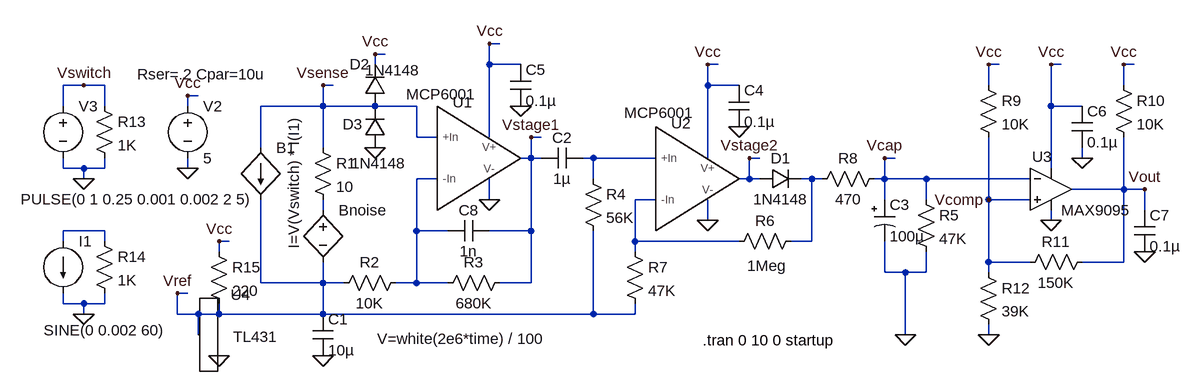
[diagram p0: schematic AutoVac1.asc]
AutoVac1.asc, the LTspice schematic file:
Version 4
SHEET 1 2052 736
WIRE 160 64 144 64
WIRE -16 80 -32 80
WIRE -32 96 -32 80
WIRE 144 96 144 64
WIRE 192 96 144 96
WIRE 496 96 480 96
WIRE 928 96 912 96
WIRE 1024 96 1008 96
WIRE 1136 96 1120 96
WIRE -480 128 -512 128
WIRE -448 128 -480 128
WIRE -96 128 -112 128
WIRE 480 128 480 96
WIRE 528 128 480 128
WIRE 912 128 912 96
WIRE 1120 128 1120 96
WIRE -304 144 -320 144
WIRE -512 160 -512 128
WIRE -448 160 -448 128
WIRE -320 160 -320 144
WIRE -112 160 -112 128
WIRE -112 160 -208 160
WIRE -32 160 -112 160
WIRE 32 160 -32 160
WIRE 1008 160 1008 96
WIRE 1056 160 1008 160
WIRE 32 208 32 160
WIRE 64 208 32 208
WIRE 144 208 144 96
WIRE 224 208 208 208
WIRE -208 224 -208 160
WIRE -112 224 -112 160
WIRE 208 240 208 208
WIRE 208 240 192 240
WIRE 224 240 208 240
WIRE 304 240 288 240
WIRE 400 240 304 240
WIRE 480 240 480 128
WIRE 560 240 544 240
WIRE 768 240 752 240
WIRE 1056 240 1056 224
WIRE -512 256 -512 240
WIRE -480 256 -512 256
WIRE -448 256 -448 240
WIRE -448 256 -480 256
WIRE -320 256 -320 240
WIRE 1008 256 1008 160
WIRE -480 272 -480 256
WIRE 64 272 32 272
WIRE 304 272 304 240
WIRE 544 272 544 240
WIRE 544 272 528 272
WIRE 560 272 544 272
WIRE 640 272 624 272
WIRE 656 272 640 272
WIRE 752 272 752 240
WIRE 752 272 736 272
WIRE 816 272 752 272
WIRE 976 272 816 272
WIRE 1120 288 1120 208
WIRE 1120 288 1040 288
WIRE 1152 288 1120 288
WIRE 144 304 144 272
WIRE 400 304 368 304
WIRE 752 304 752 272
WIRE 816 304 816 272
WIRE 912 304 912 208
WIRE 976 304 912 304
WIRE -112 320 -112 304
WIRE 1152 320 1152 288
WIRE 480 336 480 304
WIRE 1008 336 1008 320
WIRE -448 352 -512 352
WIRE 32 352 32 272
WIRE 80 352 32 352
WIRE 208 352 208 240
WIRE 208 352 144 352
WIRE -512 368 -512 352
WIRE -448 368 -448 352
WIRE -256 368 -272 368
WIRE 368 368 368 304
WIRE 528 368 368 368
WIRE 640 368 640 272
WIRE 640 368 608 368
WIRE -272 384 -272 368
WIRE 368 384 368 368
WIRE 912 400 912 304
WIRE 976 400 912 400
WIRE 1120 400 1120 288
WIRE 1120 400 1056 400
WIRE 752 416 752 368
WIRE 784 416 752 416
WIRE 816 416 816 384
WIRE 816 416 784 416
WIRE 912 416 912 400
WIRE -208 432 -208 304
WIRE -112 432 -112 400
WIRE -112 432 -208 432
WIRE -80 432 -112 432
WIRE 32 432 32 352
WIRE 32 432 0 432
WIRE 80 432 32 432
WIRE 208 432 208 352
WIRE 208 432 160 432
WIRE -320 448 -336 448
WIRE -512 464 -512 448
WIRE -480 464 -512 464
WIRE -448 464 -448 448
WIRE -448 464 -480 464
WIRE -480 480 -480 464
WIRE -336 480 -336 448
WIRE -304 480 -336 480
WIRE -272 480 -272 464
WIRE -272 480 -304 480
WIRE -112 480 -112 432
WIRE -112 480 -272 480
WIRE 304 480 304 352
WIRE 304 480 -112 480
WIRE 368 480 368 464
WIRE 368 480 304 480
WIRE -304 512 -304 480
WIRE 784 512 784 416
WIRE 912 512 912 496
FLAG -320 256 0
FLAG 144 304 0
FLAG 480 336 0
FLAG 1008 336 0
FLAG 1152 288 Vout
FLAG 208 208 Vstage1
FLAG -320 144 Vcc
FLAG 912 96 Vcc
FLAG 1120 96 Vcc
FLAG 480 96 Vcc
FLAG 1008 96 Vcc
FLAG 912 304 Vcomp
FLAG 752 240 Vcap
FLAG -480 272 0
FLAG -480 128 Vswitch
FLAG -480 480 0
FLAG -112 128 Vsense
FLAG 528 192 0
FLAG 192 160 0
FLAG 1056 240 0
FLAG 144 64 Vcc
FLAG 912 512 0
FLAG 544 240 Vstage2
FLAG 784 512 0
FLAG -112 544 0
FLAG -272 544 0
FLAG -272 368 Vcc
FLAG -336 448 Vref
FLAG -32 224 0
FLAG -32 80 Vcc
FLAG 1152 384 0
SYMBOL res -128 208 R0
SYMATTR InstName R1
SYMATTR Value 10
SYMBOL MCP6001 64 240 R0
WINDOW 3 6 -114 Top 2
SYMATTR InstName U1
SYMBOL voltage -320 144 R0
WINDOW 123 0 0 Left 0
WINDOW 39 -78 -33 Left 2
SYMATTR SpiceLine Rser=.2 Cpar=10u
SYMATTR InstName V2
SYMATTR Value 5
SYMBOL res 16 416 R90
WINDOW 0 0 56 VBottom 2
WINDOW 3 32 56 VTop 2
SYMATTR InstName R2
SYMATTR Value 10K
SYMBOL res 176 416 R90
WINDOW 0 0 56 VBottom 2
WINDOW 3 32 56 VTop 2
SYMATTR InstName R3
SYMATTR Value 680K
SYMBOL MCP6001 400 272 R0
WINDOW 3 5 -117 Top 2
SYMATTR InstName U2
SYMBOL cap 288 224 R90
WINDOW 0 0 32 VBottom 2
WINDOW 3 32 32 VTop 2
SYMATTR InstName C2
SYMATTR Value 1µ
SYMBOL res 288 256 R0
SYMATTR InstName R4
SYMATTR Value 56K
SYMBOL res 352 368 R0
SYMATTR InstName R7
SYMATTR Value 47K
SYMBOL res 624 352 R90
WINDOW 0 0 56 VBottom 2
WINDOW 3 38 53 VTop 2
SYMATTR InstName R6
SYMATTR Value 1Meg
SYMBOL polcap 736 304 R0
WINDOW 3 24 56 Left 2
SYMATTR Value 100µ
SYMATTR InstName C3
SYMATTR Description Capacitor
SYMATTR Type cap
SYMATTR SpiceLine V=12.5 Irms=2.21565 Rser=0.055 Lser=0
SYMBOL diode 560 288 R270
WINDOW 0 32 32 VTop 2
WINDOW 3 0 32 VBottom 2
SYMATTR InstName D1
SYMATTR Value 1N4148
SYMBOL res 800 288 R0
SYMATTR InstName R5
SYMATTR Value 47K
SYMBOL res 752 256 R90
WINDOW 0 0 56 VBottom 2
WINDOW 3 32 56 VTop 2
SYMATTR InstName R8
SYMATTR Value 470
SYMBOL res 896 112 R0
SYMATTR InstName R9
SYMATTR Value 10K
SYMBOL res 1104 112 R0
SYMATTR InstName R10
SYMATTR Value 10K
SYMBOL res 1072 384 R90
WINDOW 0 0 56 VBottom 2
WINDOW 3 32 56 VTop 2
SYMATTR InstName R11
SYMATTR Value 150K
SYMBOL res 896 400 R0
SYMATTR InstName R12
SYMATTR Value 39K
SYMBOL Comparators\\MAX9095 1008 288 R0
WINDOW 0 -29 -50 Left 2
SYMATTR InstName U3
SYMBOL voltage -512 144 R0
WINDOW 3 -65 159 Left 2
WINDOW 123 0 0 Left 0
WINDOW 39 0 0 Left 0
SYMATTR Value PULSE(0 1 0.25 0.001 0.002 2 5)
SYMATTR InstName V3
SYMBOL res -464 144 R0
SYMATTR InstName R13
SYMATTR Value 1K
SYMBOL bi -208 224 R0
WINDOW 3 51 -46 VRight 2
SYMATTR Value I=V(Vswitch) * I(I1)
SYMATTR InstName B1
SYMBOL current -512 368 R0
WINDOW 123 0 0 Left 0
WINDOW 39 0 0 Left 0
WINDOW 3 -30 137 Left 2
SYMATTR Value SINE(0 0.002 60)
SYMATTR InstName I1
SYMBOL res -464 352 R0
SYMATTR InstName R14
SYMATTR Value 1K
SYMBOL cap 512 128 R0
SYMATTR InstName C4
SYMATTR Value 0.1µ
SYMBOL cap 176 96 R0
SYMATTR InstName C5
SYMATTR Value 0.1µ
SYMBOL cap 1040 160 R0
SYMATTR InstName C6
SYMATTR Value 0.1µ
SYMBOL cap -128 480 R0
SYMATTR InstName C1
SYMATTR Value 10µ
SYMBOL ZZZ\\REF\\TL431 -288 480 R0
WINDOW 3 38 35 Left 2
SYMATTR InstName U4
SYMBOL res -288 368 R0
SYMATTR InstName R15
SYMATTR Value 220
SYMBOL diode -16 160 R180
WINDOW 0 24 64 Left 2
WINDOW 3 -54 55 Left 2
SYMATTR InstName D2
SYMATTR Value 1N4148
SYMBOL diode -16 224 R180
WINDOW 0 35 36 Left 2
WINDOW 3 -32 -24 Left 2
SYMATTR InstName D3
SYMATTR Value 1N4148
SYMBOL cap 1136 320 R0
SYMATTR InstName C7
SYMATTR Value 0.1µ
SYMBOL bv -112 304 R0
WINDOW 3 83 214 Left 2
SYMATTR Value V=white(2e6*time) / 100
SYMATTR InstName Bnoise
SYMBOL cap 144 336 R90
WINDOW 0 0 32 VBottom 2
WINDOW 3 32 32 VTop 2
SYMATTR InstName C8
SYMATTR Value 1n
TEXT 472 520 Left 2 !.tran 0 10 0 startup

The netlist it stands for:
* AutoVac1.asc
R1 Vsense N005 10
XU1 Vsense N002 Vcc 0 Vstage1 MCP6001  ; pins +In -In V+ V- Out
V2 Vcc 0 5 Rser=.2 Cpar=10u
R2 N002 Vref 10K
R3 Vstage1 N002 680K
XU2 N001 N004 Vcc 0 Vstage2 MCP6001  ; pins +In -In V+ V- Out
C2 N001 Vstage1 1µ
R4 N001 Vref 56K
R7 N004 Vref 47K
R6 N003 N004 1Meg
C3 Vcap 0 100µ V=12.5 Irms=2.21565 Rser=0.055 Lser=0
D1 Vstage2 N003 1N4148
R5 Vcap 0 47K
R8 Vcap N003 470
R9 Vcc Vcomp 10K
R10 Vcc Vout 10K
R11 Vout Vcomp 150K
R12 Vcomp 0 39K
* U3: MAX9095 (symbol Comparators\MAX9095 not available, pins judged from their places): In+=Vcomp In-=Vcap V+=Vcc V-=0 OUT=Vout
V3 Vswitch 0 PULSE(0 1 0.25 0.001 0.002 2 5)
R13 Vswitch 0 1K
B1 Vsense Vref I=V(Vswitch) * I(I1)
I1 N006 0 SINE(0 0.002 60)
R14 N006 0 1K
C4 Vcc 0 0.1µ
C5 Vcc 0 0.1µ
C6 Vcc 0 0.1µ
C1 Vref 0 10µ
XU4 Vref 0 Vref TL431
R15 Vcc Vref 220
D2 Vsense Vcc 1N4148
D3 0 Vsense 1N4148
C7 Vout 0 0.1µ
Bnoise N005 Vref V=white(2e6*time) / 100
C8 Vstage1 N002 1n
.model D D
.lib standard.dio
.tran 0 10 0 startup
.lib MCP6001.cir
.lib TL431.mod
.backanno
.end